# Altium schematic sheet Sheet1.SchDoc
size A4
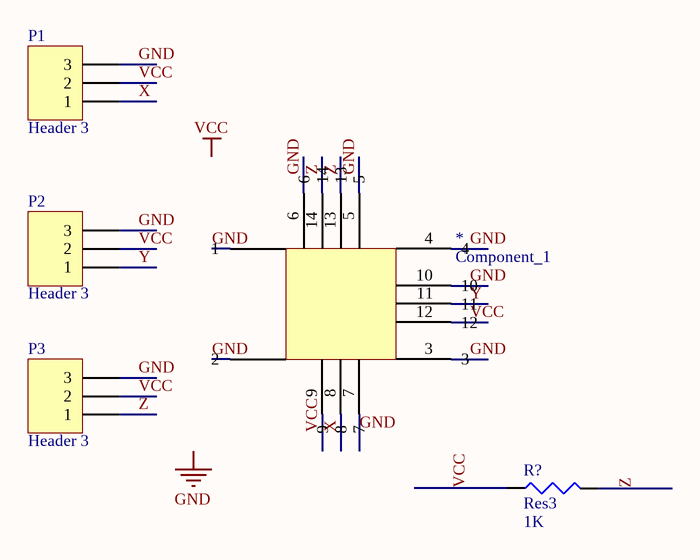
[diagram p0: Sheet1.SchDoc]

## Parts
*  Component_1  [yaogan]
P1  Header 3  [sh-2.0]
P2  Header 3  [sh-2.0]
P3  Header 3  [sh-2.0]
R?  Res3  value 1K  [1608[0603]]

## Nets
GND: P1.3 P2.3 P3.3
VCC: P1.2 P2.2 P3.2 R?.1
X: P1.1
Y: P2.1
Z: P3.1 R?.2

Not connected (* = marked no-connect by the designer): * 1 2 3 4 5 6 7 8 9 10 11 12 13 14

## Notes on the sheet
- Labels drawn without touching a wire or pin: GND, VCC

## Library data of the parts
P1-P3 = Header 3: Header, 3-Pin; LatestRevisionDate: 17-Jul-2002; LatestRevisionNote: Re-released for DXP Platform.; Publisher: Altium Limited
R? = Res3: Resistor; Published: 8-Jun-2000; LatestRevisionDate: 29-May-2009; LatestRevisionNote: IPC-7351 Footprint Added.; PackageReference: J1-0603; Publisher: Altium Limited; PackageDescription: Chip Resistor